# Altium project alps-cherry.PrjPcb
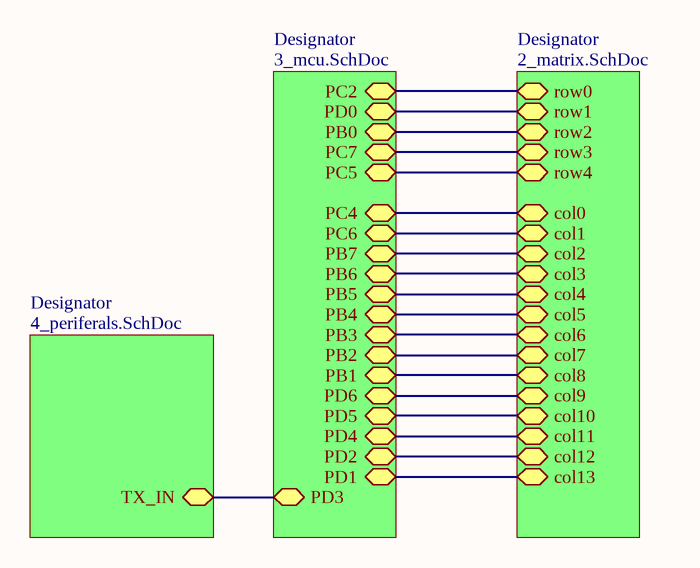
[diagram p0: 1_top.SchDoc]
4 sheets, 192 parts. Net scope: hierarchical (ports join the sheet entries above them; power ports are global).
Board file: pcb.PcbDoc
Sheets:
  1_top.SchDoc
    Designator = 2_matrix.SchDoc
    Designator = 3_mcu.SchDoc
    Designator = 4_periferals.SchDoc

## Sheet 1_top.SchDoc
size A4

### Sub-sheets
Designator = 2_matrix.SchDoc: col11, col13, col6, col8, col12, col5, col0, col10, col7, col3, col2, col1, col4, row0, col9, row3, row1, row4, row2
Designator = 3_mcu.SchDoc: PD5, PD4, PC7, PB5, PB6, PB4, PD1, PB0, PB7, PD2, PC6, PD0, PC5, PC4, PB3, PB2, PB1, PC2, PD6, PD3
Designator = 4_periferals.SchDoc: TX_IN

### Nets
col0: sheet Designator/col0, sheet Designator/PC4
col1: sheet Designator/col1, sheet Designator/PC6
col2: sheet Designator/col2, sheet Designator/PB7
col3: sheet Designator/col3, sheet Designator/PB6
col4: sheet Designator/col4, sheet Designator/PB5
col5: sheet Designator/col5, sheet Designator/PB4
col6: sheet Designator/col6, sheet Designator/PB3
col7: sheet Designator/col7, sheet Designator/PB2
col8: sheet Designator/col8, sheet Designator/PB1
col9: sheet Designator/col9, sheet Designator/PD6
col10: sheet Designator/col10, sheet Designator/PD5
col11: sheet Designator/col11, sheet Designator/PD4
col12: sheet Designator/col12, sheet Designator/PD2
col13: sheet Designator/col13, sheet Designator/PD1
PB0: sheet Designator/row2, sheet Designator/PB0
PC2: sheet Designator/row0, sheet Designator/PC2
PC5: sheet Designator/row4, sheet Designator/PC5
PC7: sheet Designator/row3, sheet Designator/PC7
PD0: sheet Designator/row1, sheet Designator/PD0
PD3: sheet Designator/PD3, sheet Designator/TX_IN

## Sheet 2_matrix.SchDoc
size A3
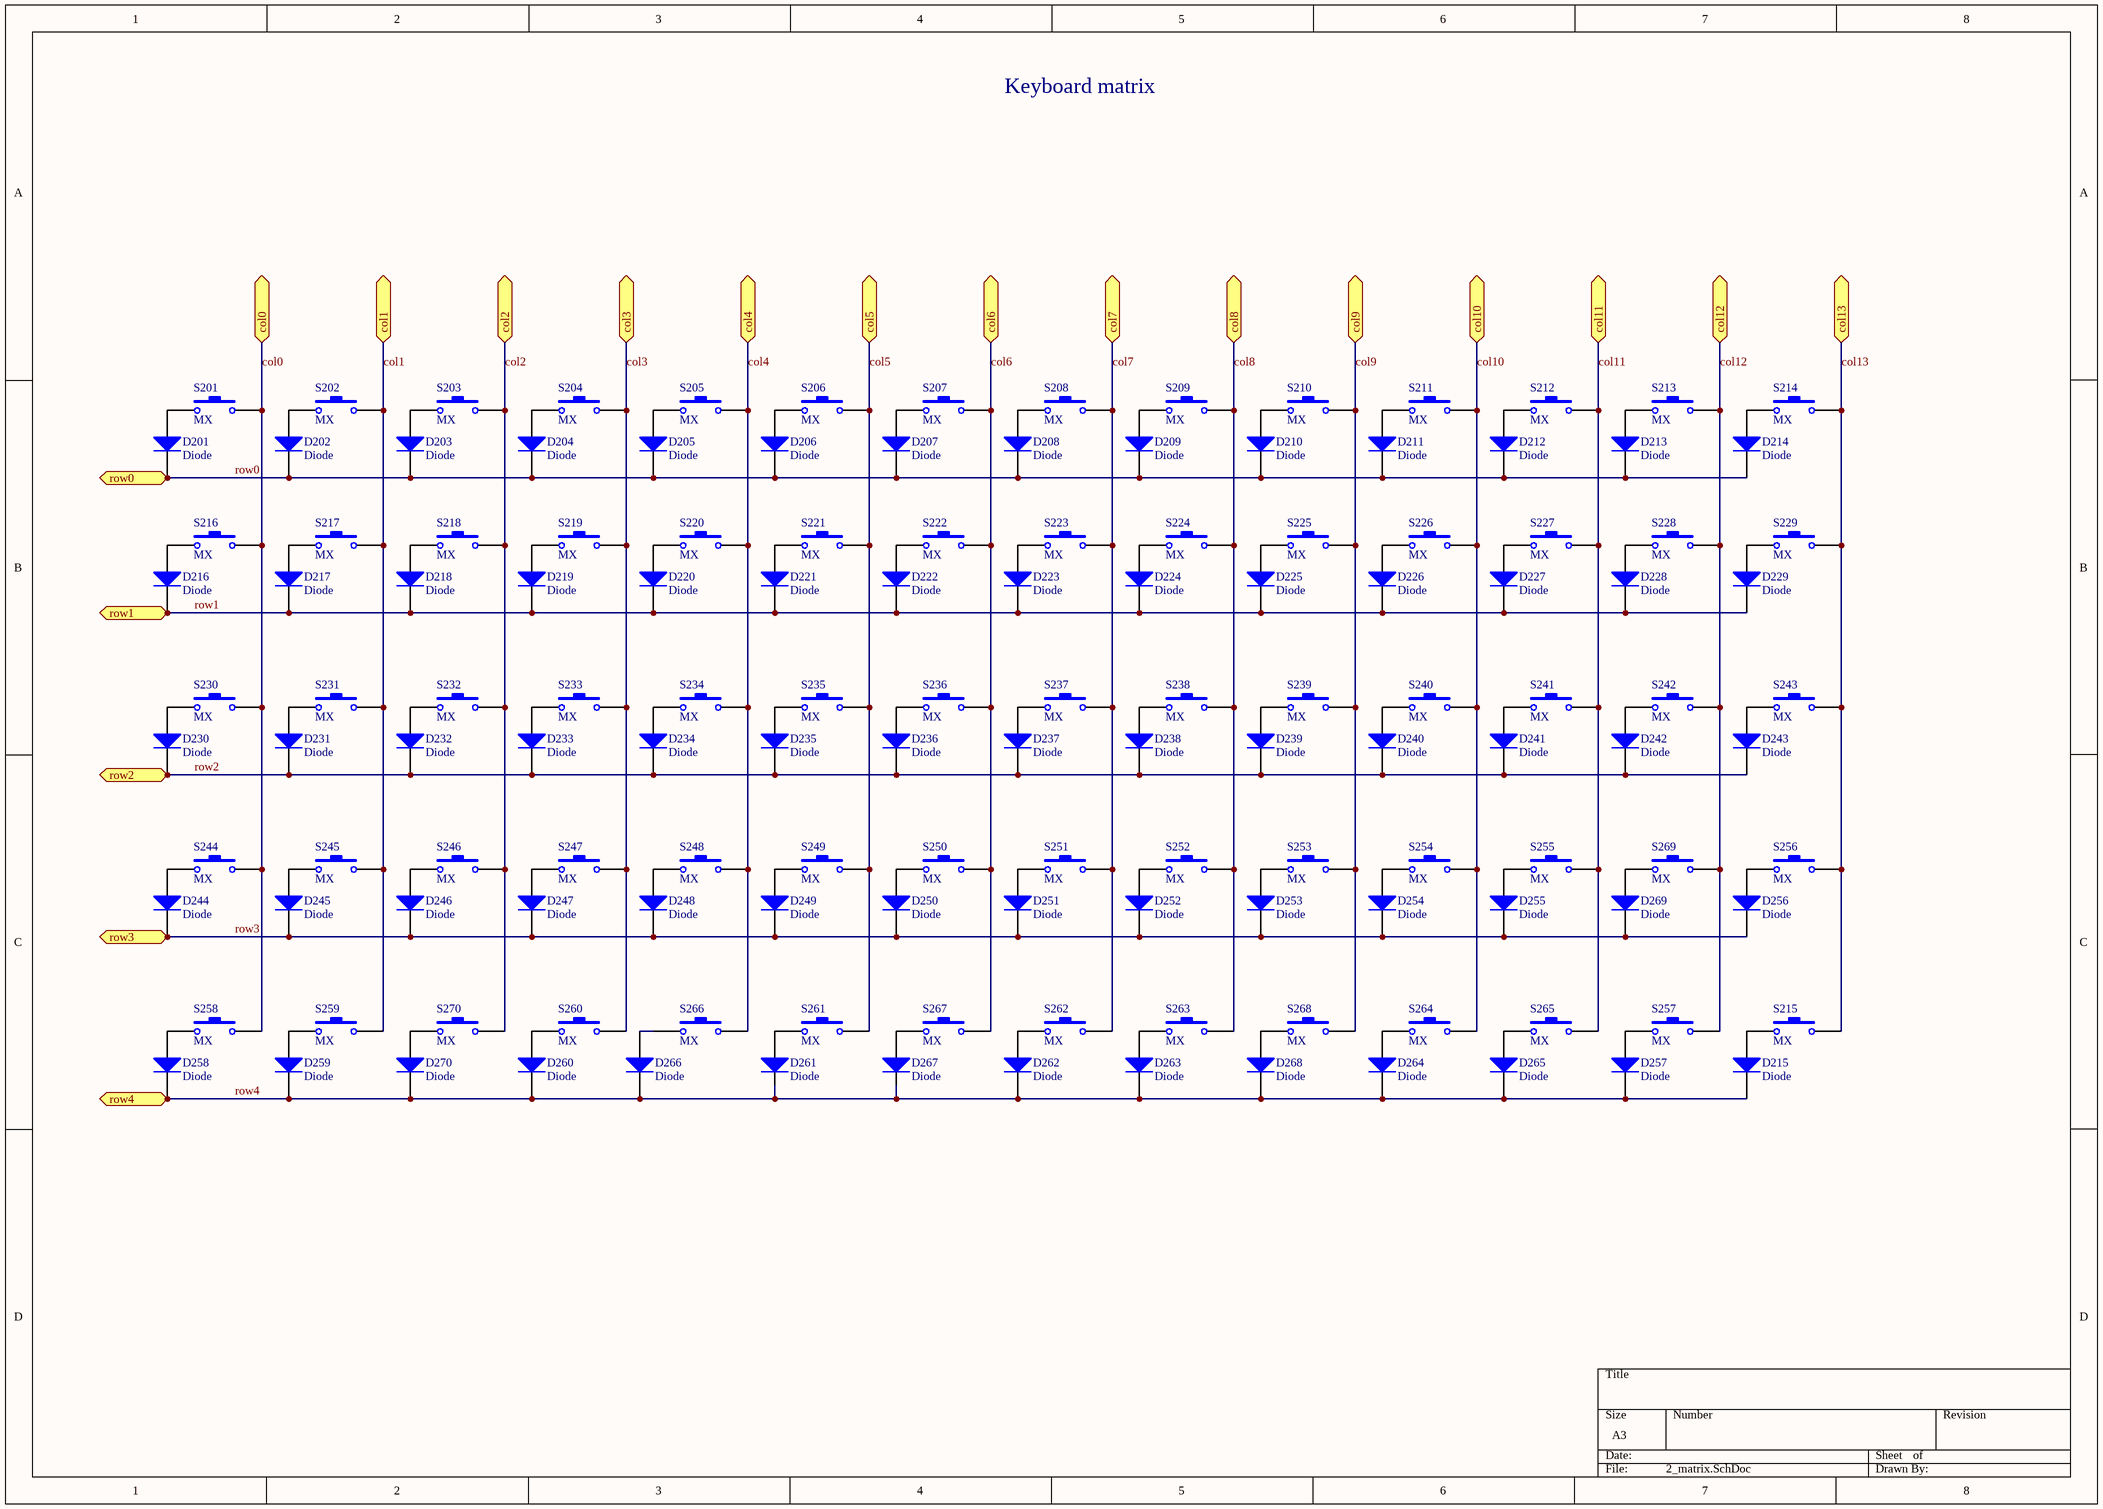
[diagram p1: 2_matrix.SchDoc]

### Parts
D201  Diode  [D0603[1608]]
D202  Diode  [D0603[1608]]
D203  Diode  [D0603[1608]]
D204  Diode  [D0603[1608]]
D205  Diode  [D0603[1608]]
D206  Diode  [D0603[1608]]
D207  Diode  [D0603[1608]]
D208  Diode  [D0603[1608]]
D209  Diode  [D0603[1608]]
D210  Diode  [D0603[1608]]
D211  Diode  [D0603[1608]]
D212  Diode  [D0603[1608]]
D213  Diode  [D0603[1608]]
D214  Diode  [D0603[1608]]
D215  Diode  [D0603[1608]]
D216  Diode  [D0603[1608]]
D217  Diode  [D0603[1608]]
D218  Diode  [D0603[1608]]
D219  Diode  [D0603[1608]]
D220  Diode  [D0603[1608]]
D221  Diode  [D0603[1608]]
D222  Diode  [D0603[1608]]
D223  Diode  [D0603[1608]]
D224  Diode  [D0603[1608]]
D225  Diode  [D0603[1608]]
D226  Diode  [D0603[1608]]
D227  Diode  [D0603[1608]]
D228  Diode  [D0603[1608]]
D229  Diode  [D0603[1608]]
D230  Diode  [D0603[1608]]
D231  Diode  [D0603[1608]]
D232  Diode  [D0603[1608]]
D233  Diode  [D0603[1608]]
D234  Diode  [D0603[1608]]
D235  Diode  [D0603[1608]]
D236  Diode  [D0603[1608]]
D237  Diode  [D0603[1608]]
D238  Diode  [D0603[1608]]
D239  Diode  [D0603[1608]]
D240  Diode  [D0603[1608]]
D241  Diode  [D0603[1608]]
D242  Diode  [D0603[1608]]
D243  Diode  [D0603[1608]]
D244  Diode  [D0603[1608]]
D245  Diode  [D0603[1608]]
D246  Diode  [D0603[1608]]
D247  Diode  [D0603[1608]]
D248  Diode  [D0603[1608]]
D249  Diode  [D0603[1608]]
D250  Diode  [D0603[1608]]
D251  Diode  [D0603[1608]]
D252  Diode  [D0603[1608]]
D253  Diode  [D0603[1608]]
D254  Diode  [D0603[1608]]
D255  Diode  [D0603[1608]]
D256  Diode  [D0603[1608]]
D257  Diode  [D0603[1608]]
D258  Diode  [D0603[1608]]
D259  Diode  [D0603[1608]]
D260  Diode  [D0603[1608]]
D261  Diode  [D0603[1608]]
D262  Diode  [D0603[1608]]
D263  Diode  [D0603[1608]]
D264  Diode  [D0603[1608]]
D265  Diode  [D0603[1608]]
D266  Diode  [D0603[1608]]
D267  Diode  [D0603[1608]]
D268  Diode  [D0603[1608]]
D269  Diode  [D0603[1608]]
D270  Diode  [D0603[1608]]
S201  MX  [SMK-switch]  (no BOM)
S202  MX  [SMK-switch]  (no BOM)
S203  MX  [SMK-switch]  (no BOM)
S204  MX  [SMK-switch]  (no BOM)
S205  MX  [SMK-switch]  (no BOM)
S206  MX  [SMK-switch]  (no BOM)
S207  MX  [SMK-switch]  (no BOM)
S208  MX  [SMK-switch]  (no BOM)
S209  MX  [SMK-switch]  (no BOM)
S210  MX  [SMK-switch]  (no BOM)
S211  MX  [SMK-switch]  (no BOM)
S212  MX  [SMK-switch]  (no BOM)
S213  MX  [SMK-switch]  (no BOM)
S214  MX  [SMK-switch]  (no BOM)
S215  MX  [SMK-switch - backspace]  (no BOM)
S216  MX  [SMK-switch - 1.5U]  (no BOM)
S217  MX  [SMK-switch]  (no BOM)
S218  MX  [SMK-switch]  (no BOM)
S219  MX  [SMK-switch]  (no BOM)
S220  MX  [SMK-switch]  (no BOM)
S221  MX  [SMK-switch]  (no BOM)
S222  MX  [SMK-switch]  (no BOM)
S223  MX  [SMK-switch]  (no BOM)
S224  MX  [SMK-switch]  (no BOM)
S225  MX  [SMK-switch]  (no BOM)
S226  MX  [SMK-switch]  (no BOM)
S227  MX  [SMK-switch]  (no BOM)
S228  MX  [SMK-switch - offset-R]  (no BOM)
S229  MX  [SMK-switch - 1.5U]  (no BOM)
S230  MX  [SMK-switch - CAPS]  (no BOM)
S231  MX  [SMK-switch]  (no BOM)
S232  MX  [SMK-switch]  (no BOM)
S233  MX  [SMK-switch]  (no BOM)
S234  MX  [SMK-switch]  (no BOM)
S235  MX  [SMK-switch]  (no BOM)
S236  MX  [SMK-switch]  (no BOM)
S237  MX  [SMK-switch]  (no BOM)
S238  MX  [SMK-switch]  (no BOM)
S239  MX  [SMK-switch]  (no BOM)
S240  MX  [SMK-switch]  (no BOM)
S241  MX  [SMK-switch]  (no BOM)
S242  MX  [SMK-switch]  (no BOM)
S243  MX  [SMK-switch - Enter]  (no BOM)
S244  MX  [SMK-switch - Left shift]  (no BOM)
S245  MX  [SMK-switch - smalleroffset-R]  (no BOM)
S246  MX  [SMK-switch - offset]  (no BOM)
S247  MX  [SMK-switch - offset]  (no BOM)
S248  MX  [SMK-switch - offset]  (no BOM)
S249  MX  [SMK-switch - offset]  (no BOM)
S250  MX  [SMK-switch - offset]  (no BOM)
S251  MX  [SMK-switch - offset]  (no BOM)
S252  MX  [SMK-switch - offset]  (no BOM)
S253  MX  [SMK-switch - offset]  (no BOM)
S254  MX  [SMK-switch - offset]  (no BOM)
S255  MX  [SMK-switch - offset]  (no BOM)
S256  MX  [SMK-switch - right shift]  (no BOM)
S257  MX  [SMK-switch - fn and shift]  (no BOM)
S258  MX  [SMK-switch - L_CTRL]  (no BOM)
S259  MX  [SMK-switch - L_WIN]  (no BOM)
S260  MX  [SMK-switch - L_alt]  (no BOM)
S261  MX  [SMK-switch - Space]  (no BOM)
S262  MX  [SMK-switch - R PN]  (no BOM)
S263  MX  [SMK-switch - R_alt]  (no BOM)
S264  MX  [SMK-switch - R_WIN]  (no BOM)
S265  MX  [SMK-switch - R_CTRL]  (no BOM)
S266  MX  [SMK-switch - L split space]  (no BOM)
S267  MX  [SMK-switch - R split space]  (no BOM)
S268  MX  [SMK-switch]  (no BOM)
S269  MX  [SMK-switch - CRAZY SHIFT]  (no BOM)
S270  MX  [SMK-switch]  (no BOM)

### Ports
col0, col1, col2, col3, col4, col5, col6, col7, col8, col9, col10, col11, col12, col13, row0, row1, row2, row3, row4

### Nets
col0: S201.2 S216.2 S230.2 S244.2 S258.2 ; port col0
col1: S202.2 S217.2 S231.2 S245.2 S259.2 ; port col1
col2: S203.2 S218.2 S232.2 S246.2 S270.2 ; port col2
col3: S204.2 S219.2 S233.2 S247.2 S260.2 ; port col3
col4: S205.2 S220.2 S234.2 S248.2 S266.2 ; port col4
col5: S206.2 S221.2 S235.2 S249.2 S261.2 ; port col5
col6: S207.2 S222.2 S236.2 S250.2 S267.2 ; port col6
col7: S208.2 S223.2 S237.2 S251.2 S262.2 ; port col7
col8: S209.2 S224.2 S238.2 S252.2 S263.2 ; port col8
col9: S210.2 S225.2 S239.2 S253.2 S268.2 ; port col9
col10: S211.2 S226.2 S240.2 S254.2 S264.2 ; port col10
col11: S212.2 S227.2 S241.2 S255.2 S265.2 ; port col11
col12: S213.2 S228.2 S242.2 S257.2 S269.2 ; port col12
col13: S214.2 S215.2 S229.2 S243.2 S256.2 ; port col13
row0: D201.2(K) D202.2(K) D203.2(K) D204.2(K) D205.2(K) D206.2(K) D207.2(K) D208.2(K) D209.2(K) D210.2(K) D211.2(K) D212.2(K) D213.2(K) D214.2(K) ; port row0  [project net PC2]
row1: D216.2(K) D217.2(K) D218.2(K) D219.2(K) D220.2(K) D221.2(K) D222.2(K) D223.2(K) D224.2(K) D225.2(K) D226.2(K) D227.2(K) D228.2(K) D229.2(K) ; port row1  [project net PD0]
row2: D230.2(K) D231.2(K) D232.2(K) D233.2(K) D234.2(K) D235.2(K) D236.2(K) D237.2(K) D238.2(K) D239.2(K) D240.2(K) D241.2(K) D242.2(K) D243.2(K) ; port row2  [project net PB0]
row3: D244.2(K) D245.2(K) D246.2(K) D247.2(K) D248.2(K) D249.2(K) D250.2(K) D251.2(K) D252.2(K) D253.2(K) D254.2(K) D255.2(K) D256.2(K) D269.2(K) ; port row3  [project net PC7]
row4: D215.2(K) D257.2(K) D258.2(K) D259.2(K) D260.2(K) D261.2(K) D262.2(K) D263.2(K) D264.2(K) D265.2(K) D266.2(K) D267.2(K) D268.2(K) D270.2(K) ; port row4  [project net PC5]
NetD201_1: D201.1(A) S201.1
NetD202_1: D202.1(A) S202.1
NetD203_1: D203.1(A) S203.1
NetD204_1: D204.1(A) S204.1
NetD205_1: D205.1(A) S205.1
NetD206_1: D206.1(A) S206.1
NetD207_1: D207.1(A) S207.1
NetD208_1: D208.1(A) S208.1
NetD209_1: D209.1(A) S209.1
NetD210_1: D210.1(A) S210.1
NetD211_1: D211.1(A) S211.1
NetD212_1: D212.1(A) S212.1
NetD213_1: D213.1(A) S213.1
NetD214_1: D214.1(A) S214.1
NetD215_1: D215.1(A) S215.1
NetD216_1: D216.1(A) S216.1
NetD217_1: D217.1(A) S217.1
NetD218_1: D218.1(A) S218.1
NetD219_1: D219.1(A) S219.1
NetD220_1: D220.1(A) S220.1
NetD221_1: D221.1(A) S221.1
NetD222_1: D222.1(A) S222.1
NetD223_1: D223.1(A) S223.1
NetD224_1: D224.1(A) S224.1
NetD225_1: D225.1(A) S225.1
NetD226_1: D226.1(A) S226.1
NetD227_1: D227.1(A) S227.1
NetD228_1: D228.1(A) S228.1
NetD229_1: D229.1(A) S229.1
NetD230_1: D230.1(A) S230.1
NetD231_1: D231.1(A) S231.1
NetD232_1: D232.1(A) S232.1
NetD233_1: D233.1(A) S233.1
NetD234_1: D234.1(A) S234.1
NetD235_1: D235.1(A) S235.1
NetD236_1: D236.1(A) S236.1
NetD237_1: D237.1(A) S237.1
NetD238_1: D238.1(A) S238.1
NetD239_1: D239.1(A) S239.1
NetD240_1: D240.1(A) S240.1
NetD241_1: D241.1(A) S241.1
NetD242_1: D242.1(A) S242.1
NetD243_1: D243.1(A) S243.1
NetD244_1: D244.1(A) S244.1
NetD245_1: D245.1(A) S245.1
NetD246_1: D246.1(A) S246.1
NetD247_1: D247.1(A) S247.1
NetD248_1: D248.1(A) S248.1
NetD249_1: D249.1(A) S249.1
NetD250_1: D250.1(A) S250.1
NetD251_1: D251.1(A) S251.1
NetD252_1: D252.1(A) S252.1
NetD253_1: D253.1(A) S253.1
NetD254_1: D254.1(A) S254.1
NetD255_1: D255.1(A) S255.1
NetD256_1: D256.1(A) S256.1
NetD257_1: D257.1(A) S257.1
NetD258_1: D258.1(A) S258.1
NetD259_1: D259.1(A) S259.1
NetD260_1: D260.1(A) S260.1
NetD261_1: D261.1(A) S261.1
NetD262_1: D262.1(A) S262.1
NetD263_1: D263.1(A) S263.1
NetD264_1: D264.1(A) S264.1
NetD265_1: D265.1(A) S265.1
NetD266_1: D266.1(A) S266.1
NetD267_1: D267.1(A) S267.1
NetD268_1: D268.1(A) S268.1
NetD269_1: D269.1(A) S269.1
NetD270_1: D270.1(A) S270.1

### Notes on the sheet
- Keyboard matrix

### Library data of the parts
D201-D270 = Diode: Default Diode; MRF.Part: CD4148WTP; MFG: Bourns Inc.; MFGPN: CD0603-B0340R; LCSC MFG: LIZ Elec; Version: 0603 imperial; LCSCPN: C109002
S201-S215 S217-S270 = SW-PB: Switch
S216 = SW-PB: TAB

## Sheet 3_mcu.SchDoc
size A4
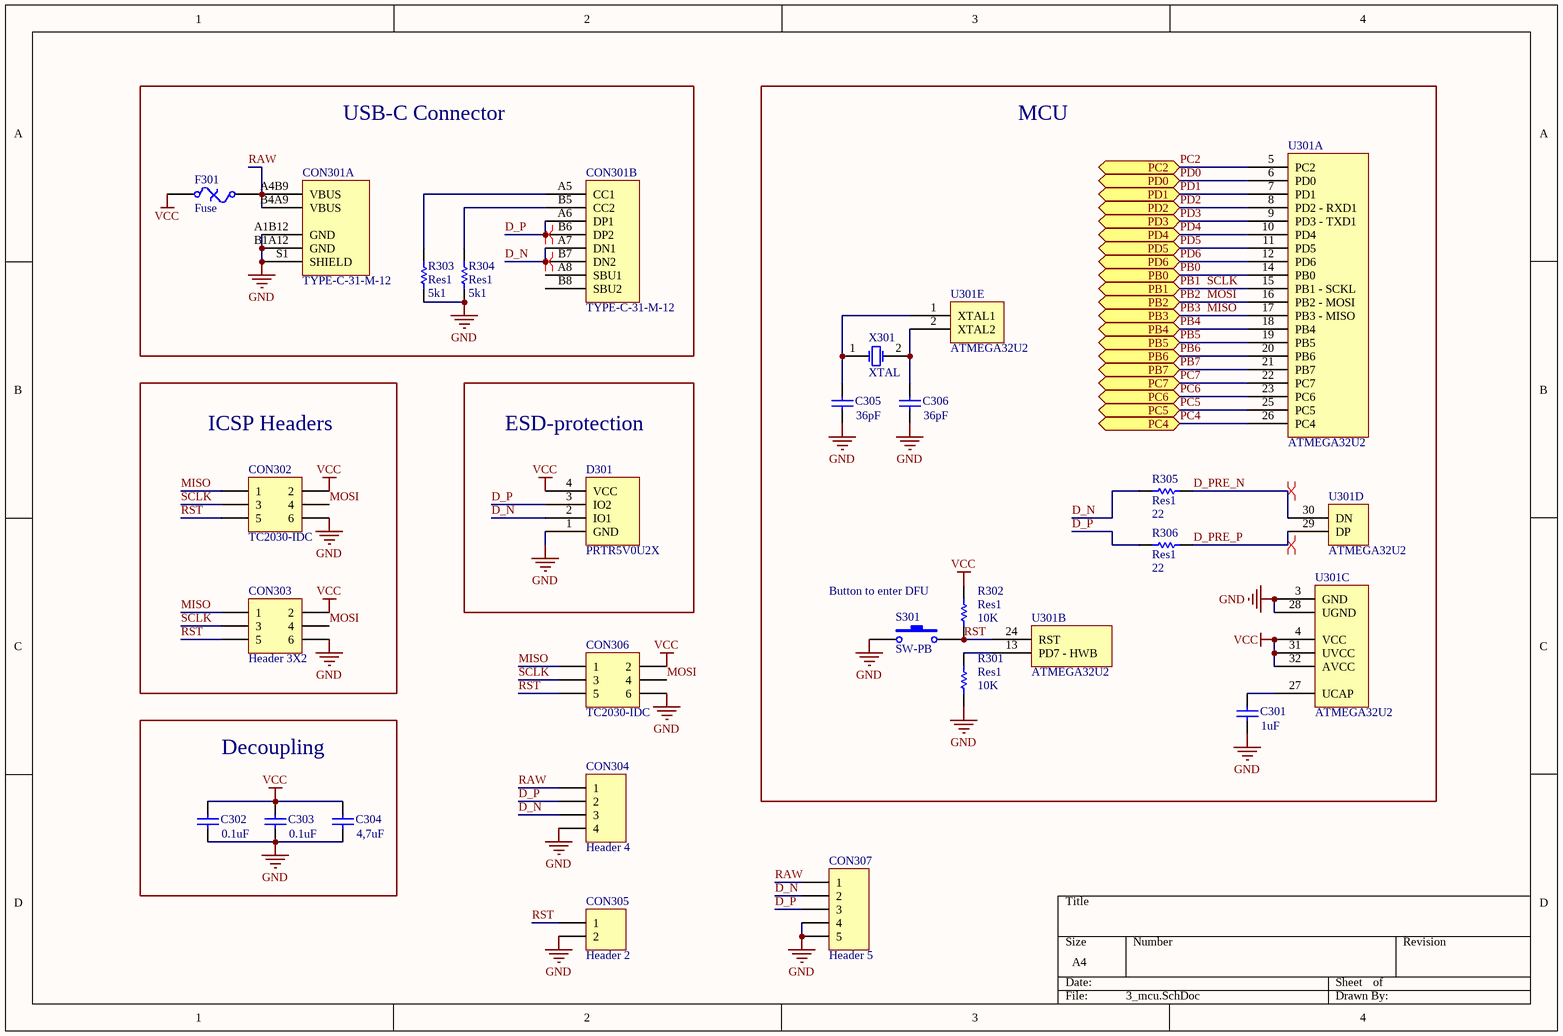
[diagram p2: 3_mcu.SchDoc]

### Parts
C301  value 1uF  [C0603[1608]]
C302  value 0.1uF  [C0603[1608]]
C303  value 0.1uF  [C0603[1608]]
C304  value 4,7uF  [C1206[3216]]
C305  value 36pF  [C0603[1608]]
C306  value 36pF  [C0603[1608]]
CON301  TYPE-C-31-M-12  [TYPE-C-31-M-12]  (parts A,B of 2)
CON302  TC2030-IDC  [TC2030-IDC-NL]  (no BOM)
CON303  Header 3X2  [HDR2X3]  (no BOM)
CON304  Header 4  [HDR1X4]  (no BOM)
CON305  Header 2  [HDR1X2]  (no BOM)
CON306  TC2030-IDC  [TC2030-IDC-NL]  (no BOM)
CON307  Header 5  [JST SM04B-SRSS-TB]
D301  PRTR5V0U2X  [SOT190P237X120-4N]
F301  Fuse  [C1206[3216]]
R301  Res1  value 10K  [R0603[1608]]
R302  Res1  value 10K  [R0603[1608]]
R303  Res1  value 5k1  [R0603[1608]]
R304  Res1  value 5k1  [R0603[1608]]
R305  Res1  value 22  [R0603[1608]]
R306  Res1  value 22  [R0603[1608]]
S301  SW-PB  [430152050826]
U301  ATMEGA32U2  [ATMEGA32U2-COMBO]  (parts A,B,C,D,E of 5)
X301  XTAL  [CTS 445-series crystal]

### Blocks framed on the sheet
USB-C Connector: CON301 F301 R303 R304
MCU: C301 C305 C306 R301 R302 R305 R306 S301 U301 X301
ICSP Headers: CON302 CON303
ESD-protection: D301
Decoupling: C302-C304

### Ports
PB0, PB1, PB2, PB3, PB4, PB5, PB6, PB7, PC2, PC4, PC5, PC6, PC7, PD0, PD1, PD2, PD3, PD4, PD5, PD6

### Nets
GND: C301.1 C302.1 C303.1 C304.1 C305.1 C306.1 CON301.A1B12(GND) CON301.B1A12(GND) CON301.S1(SHIELD) CON302.6 CON303.6 CON304.4 CON305.2 CON306.6 CON307.4 CON307.5 D301.1(GND) R301.2 R303.2 R304.2 S301.2 U301.3(GND) U301.28(UGND)
VCC: C302.2 C303.2 C304.2 CON302.2 CON303.2 CON306.2 D301.4(VCC) F301.1 R302.1 U301.4(VCC) U301.31(UVCC) U301.32(AVCC)
D_N: CON301.A7(DN1) CON301.B7(DN2) CON304.3 CON307.2 D301.2(IO1) R305.2
D_P: CON301.A6(DP1) CON301.B6(DP2) CON304.2 CON307.3 D301.3(IO2) R306.2
D_PRE_N: R305.1 U301.30(DN)
D_PRE_P: R306.1 U301.29(DP)
MISO: CON302.1 CON303.1 CON306.1 U301.17(PB3_-_MISO) ; port PB3  [also labelled PB3]  [project net col6]
MOSI: CON302.4 CON303.4 CON306.4 U301.16(PB2_-_MOSI) ; port PB2  [also labelled PB2]  [project net col7]
PB0: U301.14(PB0) ; port PB0
PB1: CON302.3 CON303.3 CON306.3 U301.15(PB1_-_SCKL) ; port PB1  [also labelled SCLK]  [project net col8]
PB4: U301.18(PB4) ; port PB4  [project net col5]
PB5: U301.19(PB5) ; port PB5  [project net col4]
PB6: U301.20(PB6) ; port PB6  [project net col3]
PB7: U301.21(PB7) ; port PB7  [project net col2]
PC2: U301.5(PC2) ; port PC2
PC4: U301.26(PC4) ; port PC4  [project net col0]
PC5: U301.25(PC5) ; port PC5
PC6: U301.23(PC6) ; port PC6  [project net col1]
PC7: U301.22(PC7) ; port PC7
PD0: U301.6(PD0) ; port PD0
PD1: U301.7(PD1) ; port PD1  [project net col13]
PD2: U301.8(PD2_-_RXD1) ; port PD2  [project net col12]
PD3: U301.9(PD3_-_TXD1) ; port PD3
PD4: U301.10(PD4) ; port PD4  [project net col11]
PD5: U301.11(PD5) ; port PD5  [project net col10]
PD6: U301.12(PD6) ; port PD6  [project net col9]
RAW: CON301.A4B9(VBUS) CON301.B4A9(VBUS) CON304.1 CON307.1 F301.2
RST: CON302.5 CON303.5 CON305.1 CON306.5 R302.2 S301.1 U301.24(RST)
NetC301_2: C301.2 U301.27(UCAP)
NetC305_2: C305.2 U301.1(XTAL1) X301.1(OSC1)
NetC306_2: C306.2 U301.2(XTAL2) X301.2(OSC2)
NetCON301_A5: CON301.A5(CC1) R303.1
NetCON301_B5: CON301.B5(CC2) R304.1
NetR301_1: R301.1 U301.13(PD7_-_HWB)

Not connected (* = marked no-connect by the designer): CON301 A8(SBU1) B8(SBU2)

### Layout directives
differential pair: D_N, D_P, D_PRE_N, D_PRE_P

### Notes on the sheet
- (near R302) Button to enter DFU

### Library data of the parts
C301 = Cap: Capacitor; MRF.Part: CL10A105KB8NNNC; MFG: KEMET; MFGPN: C0603C104M5RACTU; LCSC MFG: Samsung Electro-Mechanics; Version: 0603 imperial; LCSCPN: C15849
C302 C303 = Cap: Capacitor; MRF.Part: CC0603KRX7R9BB104; MFG: KEMET; MFGPN: C0603C104M5RACTU; LCSC MFG: YAGEO; Version: 0603 imperial; LCSCPN: C14663
C304 = Cap: Capacitor; MRF.Part: 1206B475K500NT; MFG: KEMET; MFGPN: C0603C104M5RACTU; LCSC MFG: Guangdong Fenghua Advanced Tech; Version: 1206 imperial; LCSCPN: C29823
C305 C306 = Cap: Capacitor; MRF.Part: CL10C360JB8NNNC; MFG: KEMET; MFGPN: C0603C104M5RACTU; LCSC MFG: Samsung Electro-Mechanics; Version: 0603 imperial; LCSCPN: C159790
CON301 = TYPE-C-31-M-12: MFG: Korean Hroparts Elec; MFGPN: TYPE-C-31-M-12; LCSC MFG: Korean Hroparts Elec; LCSCPN: C165948; MRF.Part: TYPE-C-31-M-12
CON302 CON303 CON306 = Header 3X2: Header, 3-Pin, Dual row
CON304 = Header 4: Header, 4-Pin
CON305 = Header 2: Header, 2-Pin
CON307 = Header 5: Header, 5-Pin; MFGPN: SM04B-SRSS-TB(LF)(SN); MFG: JST Sales America Inc.
D301 = PRTR5V0U2X: MRF.Part: UET14A05L03; MFG: Nexperia USA Inc.; MFGPN: PRTR5V0U2X,215; LCSC MFG: Brightking Elec (TAIWAN); LCSCPN: C78442
F301 = Fuse Thermal: Thermal Fuse; MRF.Part: ASMD1206-050; MFG: Bel Fuse Inc.; MFGPN: 0ZCJ0050FF2G; LCSC MFG: Shenzhen JDT Fuse; LCSCPN: C135338
R301 R302 = Res1: Resistor; MRF.Part: 0603WAF1002T5E; MFG: Panasonic Electronic Components; MFGPN: ERJ-3EKF5101V; LCSC MFG: Uniroyal Elec; Version: 0603 imperial; LCSCPN: C25804
R303 R304 = Res1: Resistor; MRF.Part: 0603WAF5101T5E; MFG: Panasonic Electronic Components; MFGPN: ERJ-3EKF5101V; LCSC MFG: Uniroyal Elec; Version: 0603 imperial; LCSCPN: C23186
R305 R306 = Res1: Resistor; MRF.Part: 0603WAF220JT5E; MFG: Panasonic Electronic Components; MFGPN: ERJ-3EKF5101V; LCSC MFG: Uniroyal Elec; Version: 0603 imperial; LCSCPN: C23345
S301 = SW-PB: Switch; MRF.Part: TS-1187A-C-D-B; MFGPN: PTS645SM43SMTR92 LFS; MFG: C&K; LCSC MFG: XKB Enterprise; LCSCPN: C318888
U301 = ATMEGA32U2: MRF.Part: ATMEGA32U2-MU; MFG: Microchip Technology; MFGPN: ATMEGA32U2-AUR; LCSC MFG: Microchip Tech; LCSCPN: C57345
X301 = XTAL: Crystal Oscillator; MRF.Part: X503216MSB2GI; LCSC MFG: Yangxing Tech; LCSCPN: C112572

## Sheet 4_periferals.SchDoc
size A4
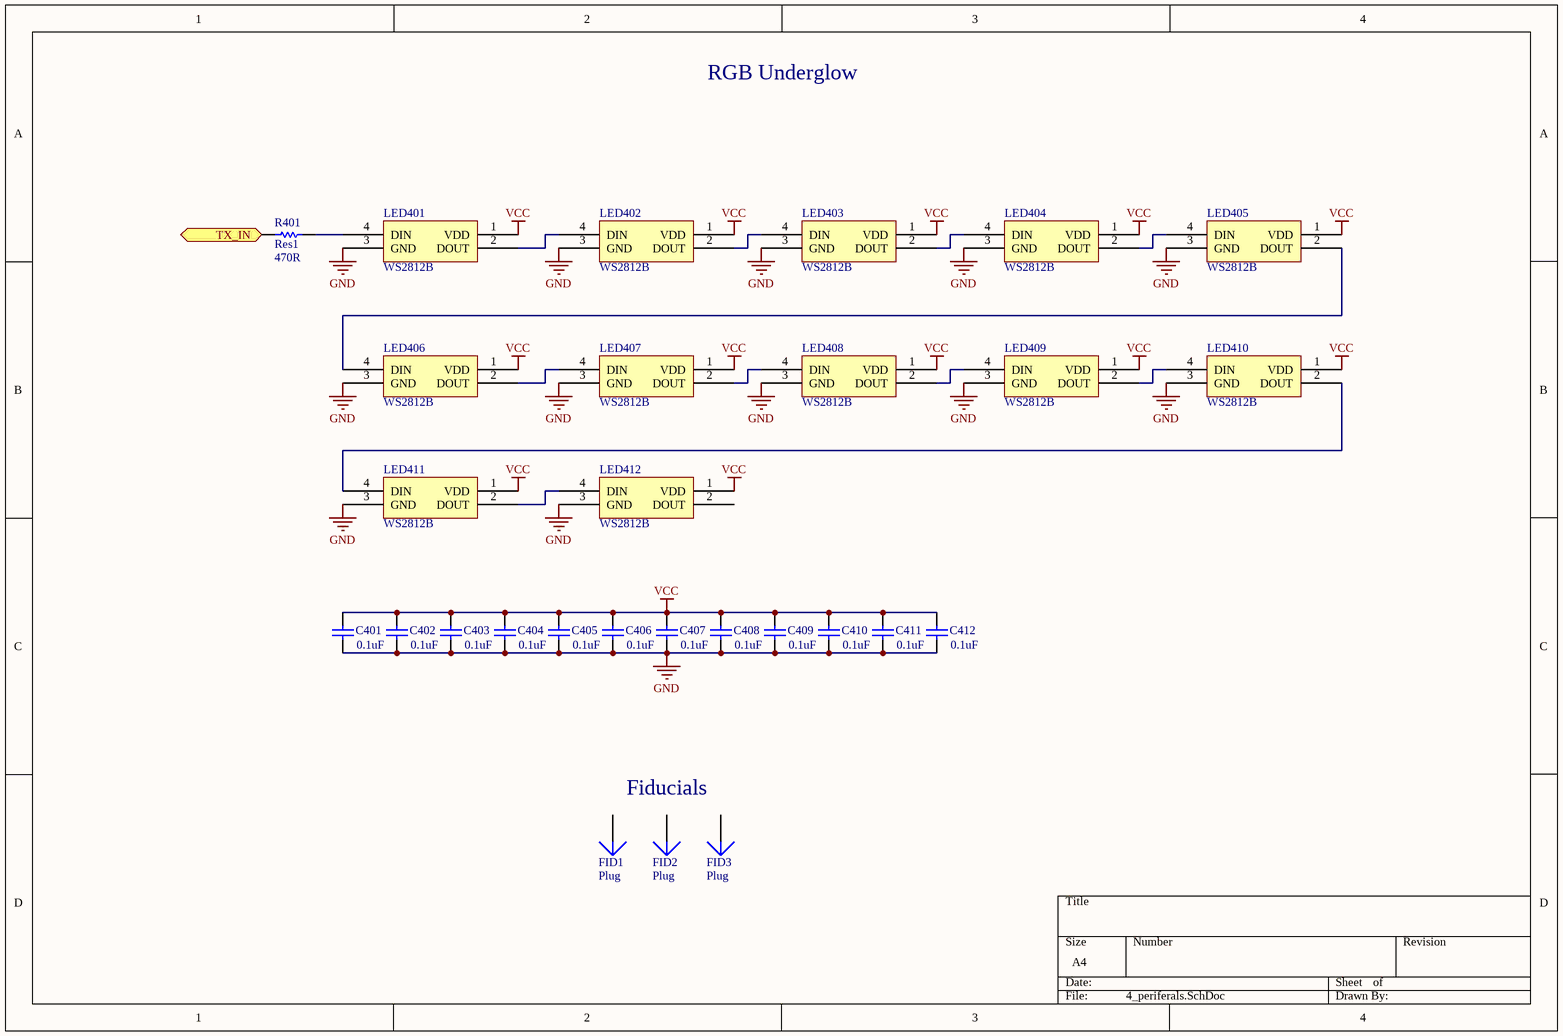
[diagram p3: 4_periferals.SchDoc]

### Parts
C401  value 0.1uF  [C0603[1608]]
C402  value 0.1uF  [C0603[1608]]
C403  value 0.1uF  [C0603[1608]]
C404  value 0.1uF  [C0603[1608]]
C405  value 0.1uF  [C0603[1608]]
C406  value 0.1uF  [C0603[1608]]
C407  value 0.1uF  [C0603[1608]]
C408  value 0.1uF  [C0603[1608]]
C409  value 0.1uF  [C0603[1608]]
C410  value 0.1uF  [C0603[1608]]
C411  value 0.1uF  [C0603[1608]]
C412  value 0.1uF  [C0603[1608]]
FID1  Plug  [Fiducial_Nordic]  (no BOM)
FID2  Plug  [Fiducial_Nordic]  (no BOM)
FID3  Plug  [Fiducial_Nordic]  (no BOM)
LED401  WS2812B  [WS2812B]
LED402  WS2812B  [WS2812B]
LED403  WS2812B  [WS2812B]
LED404  WS2812B  [WS2812B]
LED405  WS2812B  [WS2812B]
LED406  WS2812B  [WS2812B]
LED407  WS2812B  [WS2812B]
LED408  WS2812B  [WS2812B]
LED409  WS2812B  [WS2812B]
LED410  WS2812B  [WS2812B]
LED411  WS2812B  [WS2812B]
LED412  WS2812B  [WS2812B]
R401  Res1  value 470R  [R0603[1608]]

### Ports
TX_IN

### Nets
GND: C401.1 C402.1 C403.1 C404.1 C405.1 C406.1 C407.1 C408.1 C409.1 C410.1 C411.1 C412.1 LED401.3(GND) LED402.3(GND) LED403.3(GND) LED404.3(GND) LED405.3(GND) LED406.3(GND) LED407.3(GND) LED408.3(GND) LED409.3(GND) LED410.3(GND) LED411.3(GND) LED412.3(GND)
VCC: C401.2 C402.2 C403.2 C404.2 C405.2 C406.2 C407.2 C408.2 C409.2 C410.2 C411.2 C412.2 LED401.1(VDD) LED402.1(VDD) LED403.1(VDD) LED404.1(VDD) LED405.1(VDD) LED406.1(VDD) LED407.1(VDD) LED408.1(VDD) LED409.1(VDD) LED410.1(VDD) LED411.1(VDD) LED412.1(VDD)
PD3: R401.1 ; port TX_IN
NetLED401_2: LED401.2(DOUT) LED402.4(DIN)
NetLED401_4: LED401.4(DIN) R401.2
NetLED402_2: LED402.2(DOUT) LED403.4(DIN)
NetLED403_2: LED403.2(DOUT) LED404.4(DIN)
NetLED404_2: LED404.2(DOUT) LED405.4(DIN)
NetLED405_2: LED405.2(DOUT) LED406.4(DIN)
NetLED406_2: LED406.2(DOUT) LED407.4(DIN)
NetLED407_2: LED407.2(DOUT) LED408.4(DIN)
NetLED408_2: LED408.2(DOUT) LED409.4(DIN)
NetLED409_2: LED409.2(DOUT) LED410.4(DIN)
NetLED410_2: LED410.2(DOUT) LED411.4(DIN)
NetLED411_2: LED411.2(DOUT) LED412.4(DIN)

Not connected (* = marked no-connect by the designer): FID1 1; FID2 1; FID3 1; LED412 2(DOUT)

### Notes on the sheet
- RGB Underglow
- Fiducials

### Library data of the parts
C401-C412 = Cap: as C302 on sheet 3_mcu; Version: 0603 imperial; LCSCPN: C14663
R401 = Res1: Resistor; MRF.Part: 0603WAF4700T5E; MFG: Panasonic Electronic Components; MFGPN: ERJ-3EKF5101V; LCSC MFG: Uniroyal Elec; Version: 0603 imperial; LCSCPN: C23179
LED401-LED412 = WS2812B: MFGPN: WS2812B

## Nets that join several sheets
GND: 3_mcu (23 pins), 4_periferals (24 pins)
VCC: 3_mcu (12 pins), 4_periferals (24 pins)
col0: 2_matrix (5 pins), 3_mcu (U301.26)
col1: 2_matrix (5 pins), 3_mcu (U301.23)
col2: 2_matrix (5 pins), 3_mcu (U301.21)
col3: 2_matrix (5 pins), 3_mcu (U301.20)
col4: 2_matrix (5 pins), 3_mcu (U301.19)
col5: 2_matrix (5 pins), 3_mcu (U301.18)
col6: 2_matrix (5 pins), 3_mcu (CON302.1 CON303.1 CON306.1 U301.17)
col7: 2_matrix (5 pins), 3_mcu (CON302.4 CON303.4 CON306.4 U301.16)
col8: 2_matrix (5 pins), 3_mcu (CON302.3 CON303.3 CON306.3 U301.15)
col9: 2_matrix (5 pins), 3_mcu (U301.12)
col10: 2_matrix (5 pins), 3_mcu (U301.11)
col11: 2_matrix (5 pins), 3_mcu (U301.10)
col12: 2_matrix (5 pins), 3_mcu (U301.8)
col13: 2_matrix (5 pins), 3_mcu (U301.7)
PB0: 2_matrix (14 pins), 3_mcu (U301.14)
PC2: 2_matrix (14 pins), 3_mcu (U301.5)
PC5: 2_matrix (14 pins), 3_mcu (U301.25)
PC7: 2_matrix (14 pins), 3_mcu (U301.22)
PD0: 2_matrix (14 pins), 3_mcu (U301.6)
PD3: 3_mcu (U301.9), 4_periferals (R401.1)